# EAGLE design CC40CartReader (EAGLE 7.7.0)
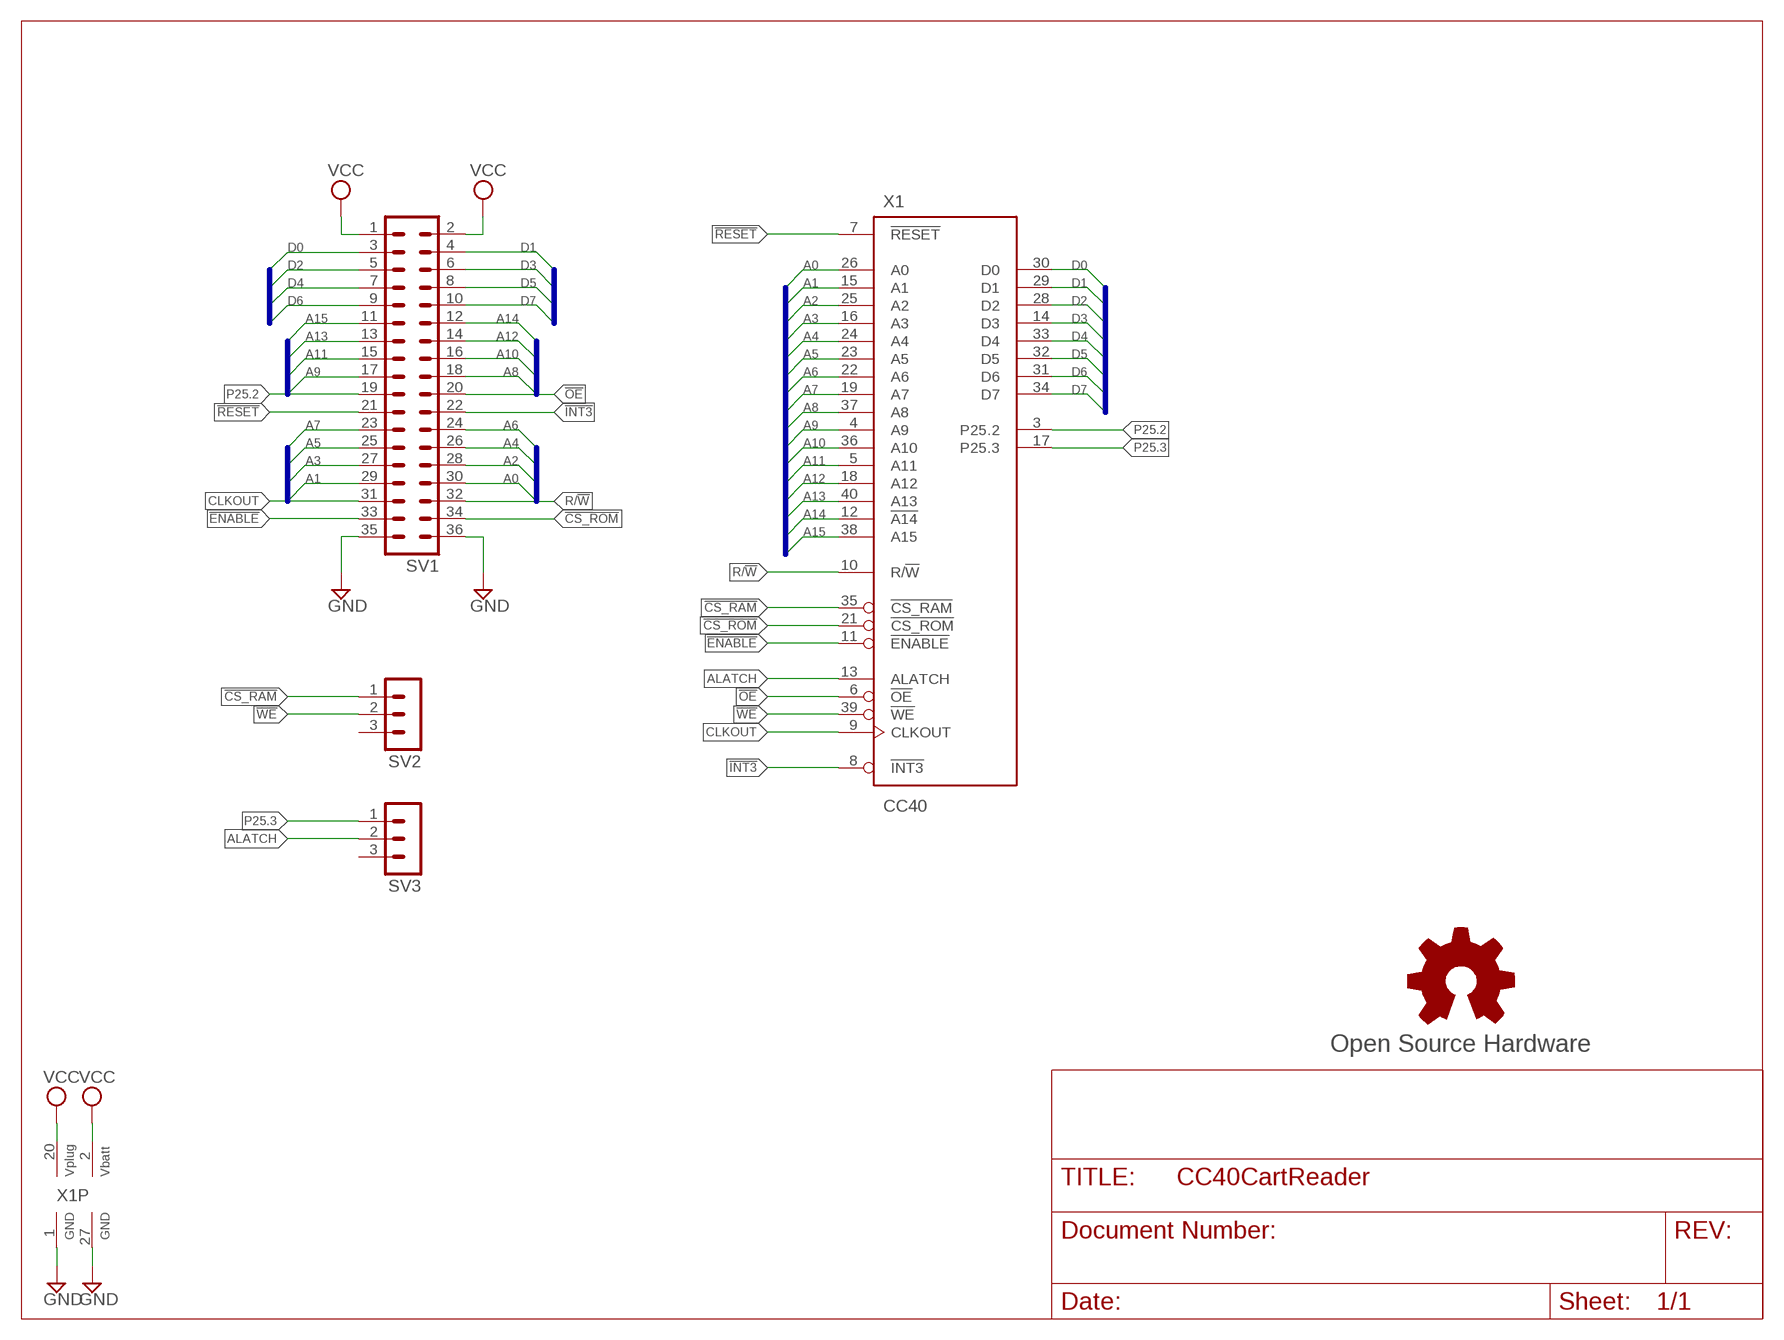
[diagram p0: schematic, sheet 1]

## Parts
GOLD_ORB_SM1  Open Source Hardware  OSHWLOGOLOGO8MM  [OSHW_8MM]
SV1  MA18-2  [MA18-2]
SV2  MA03-1  [MA03-1]
SV3  MA03-1  [MA03-1]
X1  CC40  EXPANSION_PORT_CC40C  [FE20-2(.050)SHORT]

## Nets
!CS_RAM: SV2.1 X1.35(!CS_RAM)
!CS_ROM: SV1.34 X1.21(!CS_ROM)
!ENABLE: SV1.33 X1.11(!ENABLE)
!INT3: SV1.22 X1.8(!INT3)
!OE: SV1.20 X1.6(!OE)
!RESET: SV1.21 X1.7(!RESET)
!WE: SV2.2 X1.39(!WE)
A0: SV1.30 X1.26(A0)
A1: SV1.29 X1.15(A1)
A2: SV1.28 X1.25(A2)
A3: SV1.27 X1.16(A3)
A4: SV1.26 X1.24(A4)
A5: SV1.25 X1.23(A5)
A6: SV1.24 X1.22(A6)
A7: SV1.23 X1.19(A7)
A8: SV1.18 X1.37(A8)
A9: SV1.17 X1.4(A9)
A10: SV1.16 X1.36(A10)
A11: SV1.15 X1.5(A11)
A12: SV1.14 X1.18(A12)
A13: SV1.13 X1.40(A13)
A14: SV1.12 X1.12(!A14)
A15: SV1.11 X1.38(A15)
ALATCH: SV3.2 X1.13(ALATCH)
CLKOUT: SV1.31 X1.9(CLKOUT)
D0: SV1.3 X1.30(D0)
D1: SV1.4 X1.29(D1)
D2: SV1.5 X1.28(D2)
D3: SV1.6 X1.14(D3)
D4: SV1.7 X1.33(D4)
D5: SV1.8 X1.32(D5)
D6: SV1.9 X1.31(D6)
D7: SV1.10 X1.34(D7)
GND: SV1.35 SV1.36 X1.1(GND) X1.27(GND)
P25.2: SV1.19 X1.3(P25.2)
P25.3: SV3.1 X1.17(P25.3)
R/!W: SV1.32 X1.10(R/!W)
VCC: SV1.1 SV1.2 X1.2(VBATT) X1.20(VPLUG)
Unconnected: SV2.3 SV3.3

## Buses
A[0..15]
D[0..7]

## Library data of the parts
GOLD_ORB_SM1 = oshw:OSHWLOGO: The OSHW logo for PCB layout
SV1 = con-lstb-rp:MA18-2: PIN HEADER; OC_FARNELL: unknown; OC_NEWARK: unknown
SV2 SV3 = con-lstb-rp:MA03-1: PIN HEADER; OC_FARNELL: unknown; OC_NEWARK: unknown
X1 = ti-cc40-74-95:EXPANSION_PORT_CC40

## Board
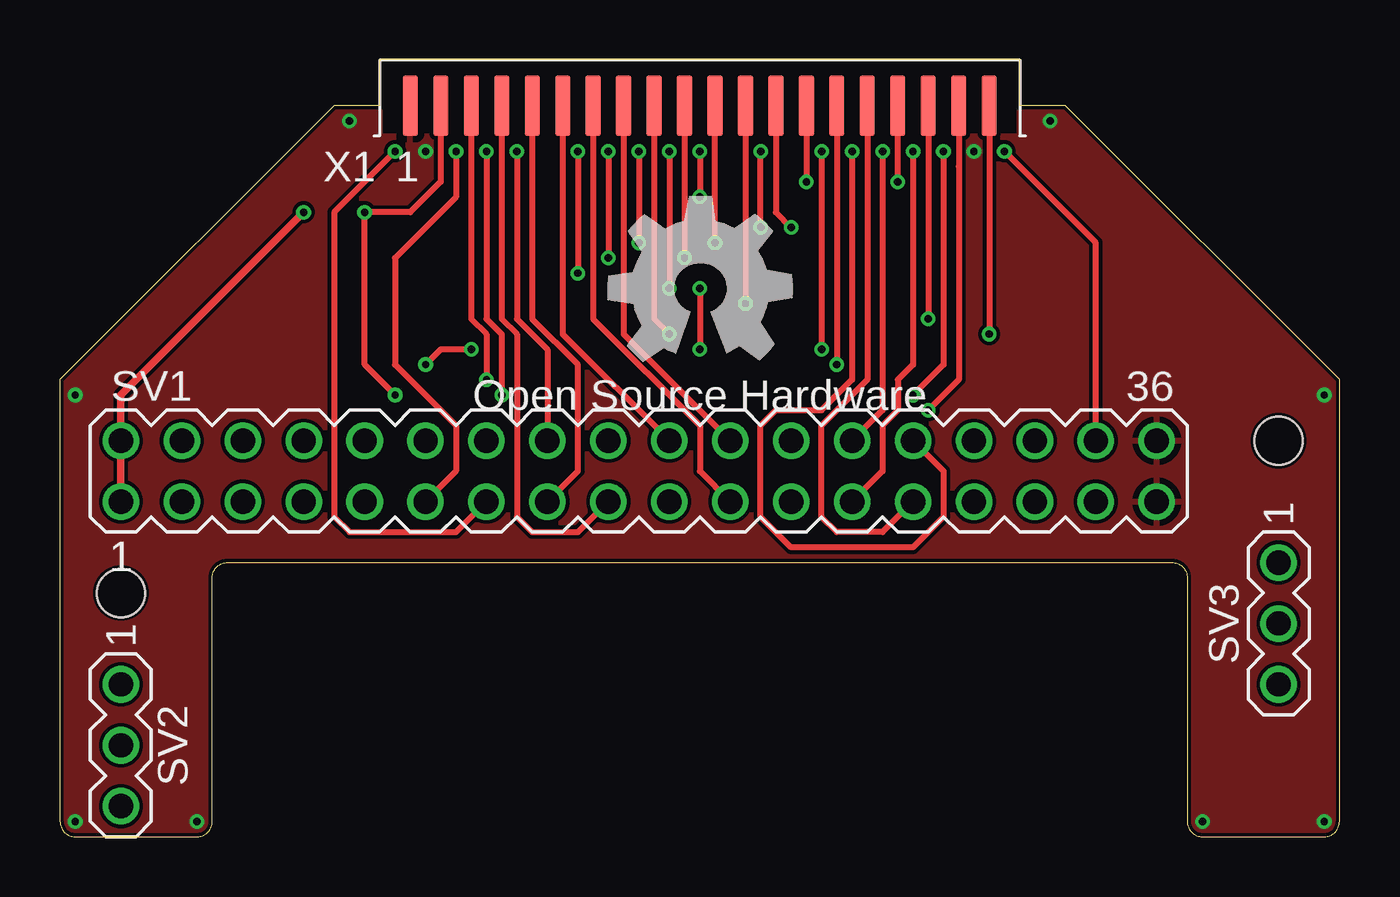
[diagram p1: board, top side]
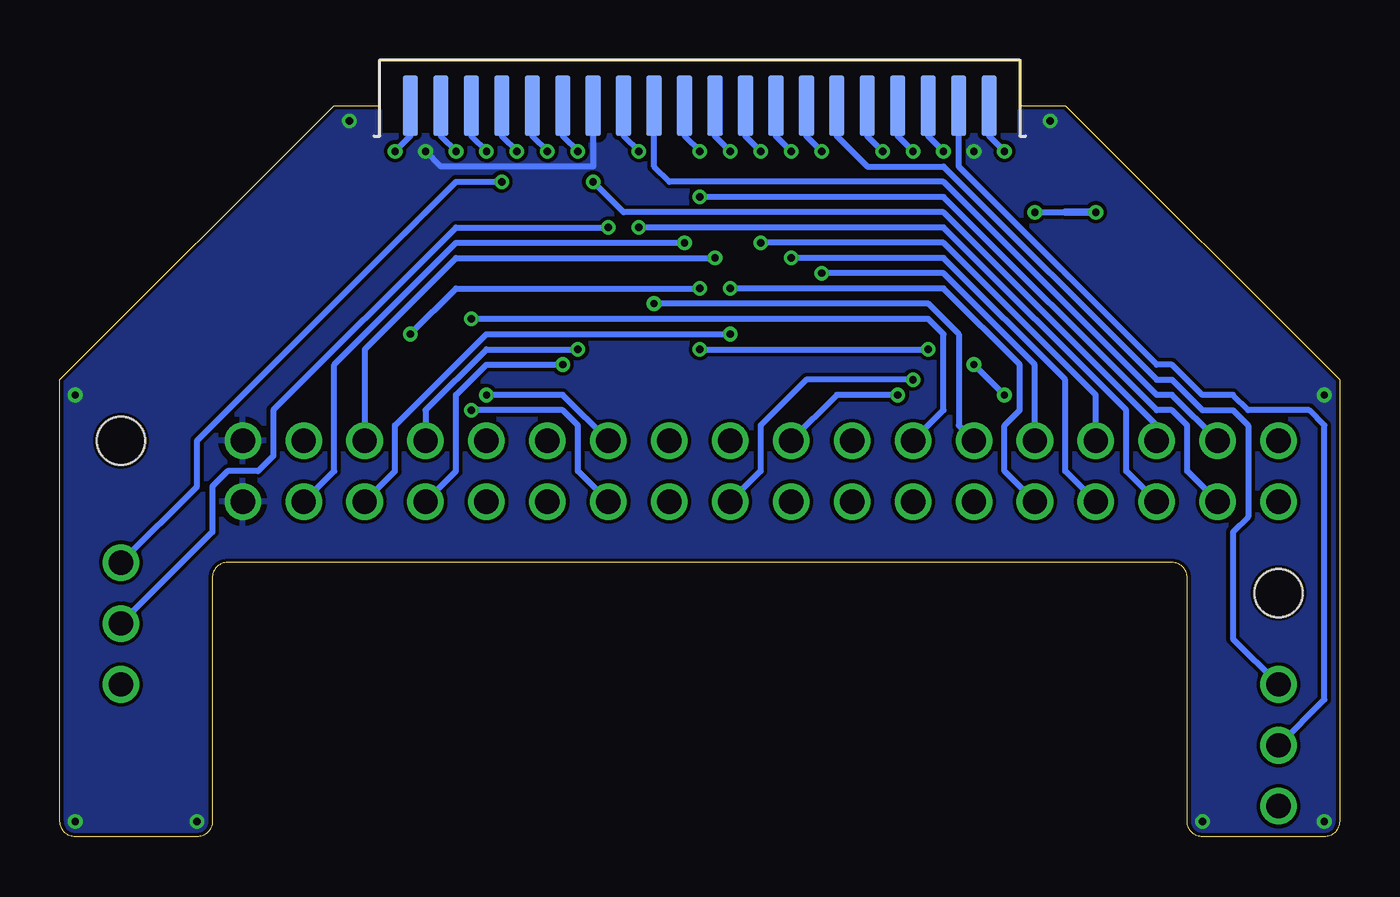
[diagram p2: board, bottom side, seen from below]

Size 53.34 x 32.38 mm. Coordinates in mm from the lower left corner, seen from the top.
Outline: 47.62,0 52.7,0 arc90 53.34,0.64 53.34,19.05 41.91,30.48 40.01,30.48 40.01,32.38 13.34,32.38 13.34,30.48 11.43,30.48 0,19.05 0,0.64 arc90 0.64,0 5.72,0 arc90 6.35,0.64 6.35,10.79 arc-90 6.99,11.43 46.36,11.43 arc-90 46.99,10.79 46.99,0.64 arc90 47.62,0
Copper layers (1*16): Top 0.035mm / dielectric 1.5mm / Bottom 0.035mm
Design rules "hackvana *": minimum track width 6mil, minimum drill 0.3mm, track to track 6mil, track to pad 6mil, pad to pad 6mil, via to via 6mil, smd to smd 0mil, copper to edge 6mil, drill to drill 6mil, minimum pad ring 10mil, minimum via ring 6mil, stop-mask expansion 2mil, vias tented up to drill 100mil, thermal gap 10mil
Holes 2 mm at 2.54,10.16 50.8,16.51

### Footprints (pad centres in the part's own frame; a part is rotated, then mirrored left to right if it is on the bottom)
MA18-2 = drill 1.016: 1 -21.59,-1.27; 2 -21.59,1.27; 3 -19.05,-1.27; 4 -19.05,1.27; 5 -16.51,-1.27; 6 -16.51,1.27; 7 -13.97,-1.27; 8 -13.97,1.27; 9 -11.43,-1.27; 10 -11.43,1.27; 11 -8.89,-1.27; 12 -8.89,1.27; 13 -6.35,-1.27; 14 -6.35,1.27; 15 -3.81,-1.27; 16 -3.81,1.27; 17 -1.27,-1.27; 18 -1.27,1.27; 19 1.27,-1.27; 20 1.27,1.27; 21 3.81,-1.27; 22 3.81,1.27; 23 6.35,-1.27; 24 6.35,1.27; 25 8.89,-1.27; 26 8.89,1.27; 27 11.43,-1.27; 28 11.43,1.27; 29 13.97,-1.27; 30 13.97,1.27; 31 16.51,-1.27; 32 16.51,1.27; 33 19.05,-1.27; 34 19.05,1.27; 35 21.59,-1.27; 36 21.59,1.27
MA03-1 = drill 1.016: 1 -2.54,0; 2 0,0; 3 2.54,0
FE20-2(.050)SHORT = smd 0.635 x 2.54: 1 -12.065,0; 2 -10.795,0; 3 -9.525,0; 4 -8.255,0; 5 -6.985,0; 6 -5.715,0; 7 -4.445,0; 8 -3.175,0; 9 -1.905,0; 10 -0.635,0; 11 0.635,0; 12 1.905,0; 13 3.175,0; 14 4.445,0; 15 5.715,0; 16 6.985,0; 17 8.255,0; 18 9.525,0; 19 10.795,0; 20 12.065,0 | smd 0.635 x 2.54 bottom: 21 12.065,0; 22 10.795,0; 23 9.525,0; 24 8.255,0; 25 6.985,0; 26 5.715,0; 27 4.445,0; 28 3.175,0; 29 1.905,0; 30 0.635,0; 31 -0.635,0; 32 -1.905,0; 33 -3.175,0; 34 -4.445,0; 35 -5.715,0; 36 -6.985,0; 37 -8.255,0; 38 -9.525,0; 39 -10.795,0; 40 -12.065,0

### Placement (x,y rotation side)
GOLD_ORB_SM1  26.67,22.86 0 top
SV1  24.13,15.24 0 top
SV2  2.54,3.81 270 top
SV3  50.8,8.89 270 top
X1  26.67,30.48 0 top

### Tracks (layer width: path | path; a pad name or v marks a point on that pad's centre or on a via)
!CS_RAM
  Bottom 0.254: X1.35 20.96,29.21 19.69,27.94 16.51,27.94 7.62,19.05 6.99,19.05 5.72,17.78 4.45,17.78 3.81,17.14 3.81,13.34 4.45,12.7 4.45,8.26 SV2.1
!CS_ROM  (via drill 0.3)
  Top 0.254: SV1.34 43.18,24.77 v39.37,28.57
  Bottom 0.254: X1.21 38.73,29.21 v39.37,28.57
!ENABLE  (via drill 0.3)
  Top 0.254: v27.31,24.77 X1.11
  Bottom 0.254: v27.31,24.77 36.83,24.77 41.91,19.68 41.91,15.24 SV1.33
!INT3
  Top 0.254: X1.8 23.5,20.95 SV1.22
!OE
  Top 0.254: X1.6 20.96,20.95 SV1.20
!RESET
  Top 0.254: X1.7 22.23,21.59 26.67,17.14 26.67,15.24 SV1.21
!WE
  Bottom 0.254: X1.39 15.88,27.94 7.62,19.68 6.99,19.68 5.72,18.41 4.45,18.41 3.81,17.78 1.27,17.78 0.64,17.14 0.64,5.71 SV2.2
A0  (via drill 0.3)
  Top 0.254: v31.75,28.57 v31.75,20.32
  Bottom 0.254: v31.75,20.32 35.56,20.32 38.1,17.78 SV1.30 | X1.26 32.39,29.21 v31.75,28.57
A1  (via drill 0.3)
  Top 0.254: X1.15 v32.39,19.68
  Bottom 0.254: v32.39,19.68 35.56,19.68 36.83,18.41 36.83,15.24 SV1.29
A2  (via drill 0.3)
  Top 0.254: v33.02,28.57 33.02,19.05 31.75,17.78 29.85,17.78 29.21,17.14 29.21,13.34 30.48,12.06 35.56,12.06 36.83,13.34 36.83,15.24 SV1.28
  Bottom 0.254: X1.25 33.66,29.21 v33.02,28.57
A3
  Top 0.254: X1.16 33.66,19.05 31.75,17.14 31.75,13.34 32.39,12.7 34.29,12.7 SV1.27
A4  (via drill 0.3)
  Top 0.254: v34.29,28.57 34.29,17.78 SV1.26
  Bottom 0.254: X1.24 34.93,29.21 v34.29,28.57
A5  (via drill 0.3)
  Top 0.254: v35.56,28.57 35.56,19.68 34.93,19.05 34.93,17.78 34.29,17.14 34.29,15.24 SV1.25
  Bottom 0.254: X1.23 36.2,29.21 v35.56,28.57
A6  (via drill 0.3)
  Top 0.254: v36.83,28.57 36.83,19.68 v35.56,18.41
  Bottom 0.254: X1.22 37.47,29.21 v36.83,28.57 | v35.56,18.41 32.39,18.41 SV1.24
A7  (via drill 0.3)
  Top 0.254: X1.19 37.47,27.94 37.47,19.05 v36.2,17.78
  Bottom 0.254: v36.2,17.78 32.39,17.78 31.75,17.14 31.75,15.24 SV1.23
A8  (via drill 0.3)
  Top 0.254: v17.78,28.57 17.78,21.59 18.41,20.95 v18.41,18.41
  Bottom 0.254: X1.37 18.41,29.21 v17.78,28.57 | v18.41,18.41 20.96,18.41 SV1.18
A9
  Top 0.254: X1.4 18.41,21.59 19.05,20.95 19.05,13.34 19.69,12.7 21.59,12.7 SV1.17
A10  (via drill 0.3)
  Top 0.254: v19.05,28.57 19.05,21.59 20.32,20.32 SV1.16
  Bottom 0.254: X1.36 19.69,29.21 v19.05,28.57
A11
  Top 0.254: X1.5 19.69,21.59 21.59,19.68 21.59,15.24 SV1.15
A12  (via drill 0.3)
  Top 0.254: X1.18 v36.2,21.59
  Bottom 0.254: v36.2,21.59 17.15,21.59 16.51,20.95 16.51,17.78 SV1.14
A13  (via drill 0.3)
  Top 0.254: v13.97,28.57 11.43,26.04 11.43,13.34 12.07,12.7 16.51,12.7 SV1.13
  Bottom 0.254: X1.40 14.61,29.21 v13.97,28.57
A14  (via drill 0.3)
  Top 0.254: X1.12 v28.58,22.23
  Bottom 0.254: v28.58,22.23 17.15,22.23 15.88,20.95 15.88,17.14 SV1.12
A15  (via drill 0.3)
  Top 0.254: v16.51,28.57 16.51,26.67 13.97,24.13 13.97,19.68 16.51,17.14 16.51,15.24 SV1.11
  Bottom 0.254: X1.38 17.15,29.21 v16.51,28.57
ALATCH  (via drill 0.3)
  Top 0.254: X1.13 29.85,26.04 v30.48,25.4
  Bottom 0.254: v30.48,25.4 36.83,25.4 44.45,17.78 44.45,15.88 45.09,15.24 46.36,15.24 46.99,14.61 46.99,12.7 SV3.2
CLKOUT  (via drill 0.3)
  Top 0.254: X1.9 24.77,21.59 v25.4,20.95
  Bottom 0.254: v25.4,20.95 35.56,20.95 39.37,17.14 39.37,15.24 SV1.31
D0  (via drill 0.3)
  Top 0.254: v26.67,28.57 v26.67,26.67
  Bottom 0.254: X1.30 27.31,29.21 v26.67,28.57 | v26.67,26.67 16.51,26.67 7.62,17.78 6.99,17.78 6.35,17.14 6.35,15.24 SV1.3
D1
  Bottom 0.254: X1.29 28.58,27.94 27.94,27.3 16.51,27.3 7.62,18.41 6.99,18.41 SV1.4
D2  (via drill 0.3)
  Top 0.254: v29.21,25.4 v29.21,28.57
  Bottom 0.254: X1.28 29.85,29.21 v29.21,28.57 | v29.21,25.4 16.51,25.4 8.89,17.78 8.89,15.24 SV1.5
D3  (via drill 0.3)
  Top 0.254: X1.14 v31.12,27.3
  Bottom 0.254: v31.12,27.3 29.85,26.04 16.51,26.04 7.62,17.14 SV1.6
D4  (via drill 0.3)
  Top 0.254: v22.86,28.57 v22.86,24.13
  Bottom 0.254: X1.33 23.5,29.21 v22.86,28.57 | v22.86,24.13 16.51,24.13 11.43,19.05 11.43,15.24 SV1.7
D5  (via drill 0.3)
  Top 0.254: v24.13,28.57 v24.13,24.77
  Bottom 0.254: X1.32 24.77,29.21 v24.13,28.57 | v24.13,24.77 16.51,24.77 10.16,18.41 SV1.8
D6  (via drill 0.3)
  Top 0.254: v25.4,28.57 v25.4,22.86
  Bottom 0.254: X1.31 26.04,29.21 v25.4,28.57 | v25.4,22.86 16.51,22.86 13.34,19.68 13.34,17.78 13.97,17.14 13.97,15.24 SV1.9
D7  (via drill 0.3)
  Top 0.254: v21.59,28.57 v21.59,23.5
  Bottom 0.254: X1.34 22.23,29.21 v21.59,28.57 | v21.59,23.5 16.51,23.5 12.7,19.68 SV1.10
GND  (via drill 0.3)
  Bottom 0.254: v38.1,28.57 37.47,27.94 31.12,27.94 X1.27
  other vias: 15.24,28.57 12.07,29.84 0.64,18.41 0.64,0.64 5.72,0.64 47.62,0.64 52.7,0.64 52.7,18.41 41.28,29.84
  pour Top: 53.34,19.05 53.34,0.64 arc-90 52.7,0 47.62,0 arc-90 46.99,0.64 46.99,10.79 arc90 46.36,11.43 6.99,11.43 arc90 6.35,10.79 6.35,0.64 arc-90 5.72,0 0.64,0 arc-90 0,0.64 0,19.05 11.43,30.48 13.34,30.48 13.34,29.21 40.01,29.21 40.01,30.48 41.91,30.48
  pour Bottom: 53.34,19.05 53.34,0.64 arc-90 52.7,0 47.62,0 arc-90 46.99,0.64 46.99,10.79 arc90 46.36,11.43 6.99,11.43 arc90 6.35,10.79 6.35,0.64 arc-90 5.72,0 0.64,0 arc-90 0,0.64 0,19.05 10.16,29.21 11.43,30.48 12.7,30.48 13.34,30.48 13.34,29.21 40.01,29.21 40.01,30.48 41.91,30.48 43.18,29.21
P25.2  (via drill 0.3)
  Top 0.254: X1.3 17.15,21.59 17.78,20.95 v17.78,19.05
  Bottom 0.254: v17.78,19.05 22.23,19.05 24.13,17.14 24.13,15.24 SV1.19
P25.3  (via drill 0.3)
  Top 0.254: v34.93,27.3 X1.17
  Bottom 0.254: v34.93,27.3 36.83,27.3 47.62,16.51 47.62,14.61 SV3.1
R/!W  (via drill 0.3)
  Top 0.254: X1.10 v26.04,24.13
  Bottom 0.254: v26.04,24.13 36.83,24.13 40.64,20.32 SV1.32
VCC  (via drill 0.3)
  Top 0.254: X1.2 15.88,27.3 14.61,26.04 v12.7,26.04 12.7,19.68 v13.97,18.41 | X1.20 v38.73,20.95 | v26.67,22.86 v26.67,20.32 | v17.15,20.32 15.88,20.32 v15.24,19.68
  Top 0.305: SV1.1 SV1.2 2.54,18.41 v10.16,26.04
  Bottom 0.254: v12.7,26.04 11.43,26.04 | v38.73,20.95 36.83,22.86 v26.67,22.86 | v26.67,20.32 v17.15,20.32 | v15.24,19.68 v13.97,18.41
  Bottom 0.305: v10.16,26.04 11.43,26.04